# Altium schematic sheet AVRControlBoardMain.SchDoc
size A4
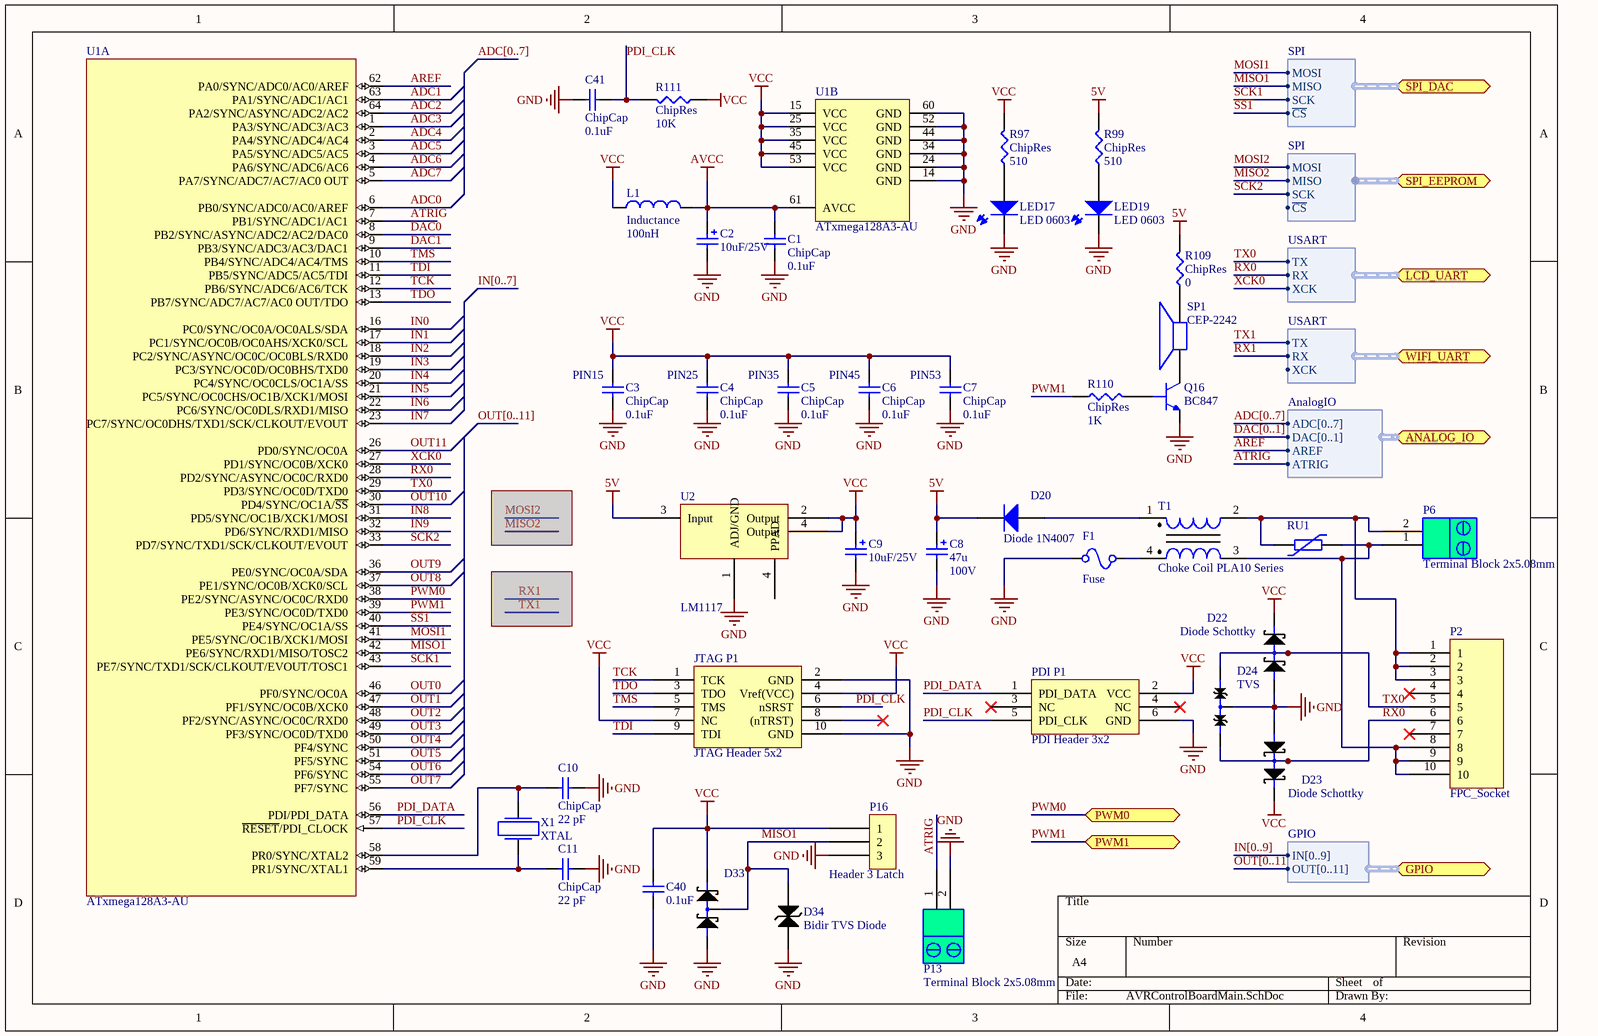
[diagram p0: AVRControlBoardMain.SchDoc]

## Parts
C1  ChipCap  value 0.1uF  [CAP0805]
C2  value 10uF/25V  [CAPC7343]  (hidden comment: Cap Pol SMD)
C3  ChipCap  value 0.1uF  [CAP0805]
C4  ChipCap  value 0.1uF  [CAP0805]
C5  ChipCap  value 0.1uF  [CAP0805]
C6  ChipCap  value 0.1uF  [CAP0805]
C7  ChipCap  value 0.1uF  [CAP0805]
C8  value 47u  Voltage: 100V  [CAPPR5-10x17_1]  (hidden comment: Cap Pol 100/47)
C9  value 10uF/25V  [CAPC7343]  (hidden comment: Cap Pol SMD)
C10  ChipCap  value 22 pF  [CAP0805]
C11  ChipCap  value 22 pF  [CAP0805]
C40  value 0.1uF  [CAP0805]  (hidden comment: ChipCap)
C41  ChipCap  value 0.1uF  [CAP0805]
D20  Diode 1N4007  [DO-41]
D22  Diode Schottky  [SOT23]
D23  Diode Schottky  [SOT23]
D24  TVS  [SOT23]
D33  Diode Schottky  [SOT23]  (value not drawn)
D34  Bidir TVS Diode  [DO-214AS]
F1  Fuse  [PTC1812]
JTAG_P1  JTAG Header 5x2  [Header 5x2]
L1  Inductance  value 100nH  [CM45]
LED17  LED 0603  [PLCC-2]
LED19  LED 0603  [PLCC-2]
P2  FPC_Socket  [Molex FPC/FFC 10pin]
P6  Terminal Block 2x5.08mm  [Socket 2x5.08]
P13  Terminal Block 2x5.08mm  [Socket 2x5.08]
P16  Header 3 Latch  [Header 3 latch]
PDI_P1  PDI Header 3x2  [Header 3x2]
Q16  BC847  [SOT23]
R97  ChipRes  value 510  [RES0805]
R99  ChipRes  value 510  [RES0805]
R109  ChipRes  value 0  [RES0805]
R110  ChipRes  value 1K  [RES0805]
R111  ChipRes  value 10K  [RES0805]
RU1  Varistor S14F25  [S14K25]  (value not drawn)
SP1  CEP-2242  [Buzzer]
T1  Choke Coil PLA10 Series  [PLA10]
U1  ATxmega128A3-AU  [64A_L]  (parts A,B of 2)
U2  LM1117  [SOT223-4M]
X1  XTAL  [BCY-W2/E4.7]

## Ports
ANALOG_IO (harness AnalogIO), GPIO (harness GPIO), LCD_UART (harness USART), PWM0, PWM1, SPI_DAC (harness SPI), SPI_EEPROM (harness SPI), WIFI_UART (harness USART)

## Harnesses
SPI: MOSI, MISO, SCK, ~{CS}
USART: TX, RX, XCK
AnalogIO: ADC[0..7], DAC[0..1], AREF, ATRIG
GPIO: IN[0..9], OUT[0..11]

## Nets
5V: C8.1 D20.2(K) R99.2 R109.2 U2.3(Input)
AVCC: C1.2 C2.1 L1.1 U1.61(AVCC)
GND: C1.1 C2.2 C3.1 C4.1 C5.1 C6.1 C7.1 C8.2 C9.2 C10.1 C11.1 C40.2 C41.1 D22.1 D23.1 D24.3 D33.1 D34.2 F1.1 JTAG_P1.2(GND) JTAG_P1.10(GND) LED17.1 LED19.1 P13.2 P16.3 PDI_P1.6(GND) Q16.2 U1.14(GND) U1.24(GND) U1.34(GND) U1.44(GND) U1.52(GND) U1.60(GND) U2.1(ADJ/GND)
VCC: C3.2 C4.2 C5.2 C6.2 C7.2 C9.1 C40.1 D22.2 D23.2 D33.2 JTAG_P1.4(Vref(VCC)) JTAG_P1.7(NC) L1.2 P16.1 PDI_P1.2(VCC) R97.2 R111.1 U1.15(VCC) U1.25(VCC) U1.35(VCC) U1.45(VCC) U1.53(VCC) U2.2(Output) U2.4(PPAD)
ADC0: U1.6(PB0/SYNC/ADC0/AC0/AREF)
ADC1: U1.63(PA1/SYNC/ADC1/AC1)
ADC2: U1.64(PA2/SYNC/ASYNC/ADC2/AC2)
ADC3: U1.1(PA3/SYNC/ADC3/AC3)
ADC4: U1.2(PA4/SYNC/ADC4/AC4)
ADC5: U1.3(PA5/SYNC/ADC5/AC5)
ADC6: U1.4(PA6/SYNC/ADC6/AC6)
ADC7: U1.5(PA7/SYNC/ADC7/AC7/AC0_OUT)
AREF: U1.62(PA0/SYNC/ADC0/AC0/AREF) ; port ANALOG_IO.AREF
ATRIG: P13.1 U1.7(PB1/SYNC/ADC1/AC1) ; port ANALOG_IO.ATRIG
DAC0: U1.8(PB2/SYNC/ASYNC/ADC2/AC2/DAC0)
DAC1: U1.9(PB3/SYNC/ADC3/AC3/DAC1)
IN0: U1.16(PC0/SYNC/OC0A/OC0ALS/SDA)
IN1: U1.17(PC1/SYNC/OC0B/OC0AHS/XCK0/SCL)
IN2: U1.18(PC2/SYNC/ASYNC/OC0C/OC0BLS/RXD0)
IN3: U1.19(PC3/SYNC/OC0D/OC0BHS/TXD0)
IN4: U1.20(PC4/SYNC/OC0CLS/OC1A/SS)
IN5: U1.21(PC5/SYNC/OC0CHS/OC1B/XCK1/MOSI)
IN6: U1.22(PC6/SYNC/OC0DLS/RXD1/MISO)
IN7: U1.23(PC7/SYNC/OC0DHS/TXD1/SCK/CLKOUT/EVOUT)
IN8: U1.31(PD5/SYNC/OC1B/XCK1/MOSI)
IN9: U1.32(PD6/SYNC/RXD1/MISO)
MISO1: D33.3 D34.1 P16.2 U1.42(PE6/SYNC/RXD1/MISO/TOSC2) ; port SPI_DAC.MISO
MISO2: port SPI_EEPROM.MISO
MOSI1: U1.41(PE5/SYNC/OC1B/XCK1/MOSI) ; port SPI_DAC.MOSI
MOSI2: port SPI_EEPROM.MOSI
OUT0: U1.46(PF0/SYNC/OC0A)
OUT1: U1.47(PF1/SYNC/OC0B/XCK0)
OUT2: U1.48(PF2/SYNC/ASYNC/OC0C/RXD0)
OUT3: U1.49(PF3/SYNC/OC0D/TXD0)
OUT4: U1.50(PF4/SYNC)
OUT5: U1.51(PF5/SYNC)
OUT6: U1.54(PF6/SYNC)
OUT7: U1.55(PF7/SYNC)
OUT8: U1.37(PE1/SYNC/OC0B/XCK0/SCL)
OUT9: U1.36(PE0/SYNC/OC0A/SDA)
OUT10: U1.30(PD4/SYNC/OC1A/~{SS})
OUT11: U1.26(PD0/SYNC/OC0A)
PDI_CLK: C41.2 JTAG_P1.6(nSRST) PDI_P1.5(PDI_CLK) R111.2 U1.57(~{RESET}/PDI_CLOCK)
PDI_DATA: PDI_P1.1(PDI_DATA) U1.56(PDI/PDI_DATA)
PWM0: U1.38(PE2/SYNC/ASYNC/OC0C/RXD0) ; port PWM0
PWM1: R110.1 U1.39(PE3/SYNC/OC0D/TXD0) ; port PWM1
RX0: D23.3 D24.2 P2.6 U1.28(PD2/SYNC/ASYNC/OC0C/RXD0) ; port LCD_UART.RX
RX1: port WIFI_UART.RX
~{SS1}: U1.40(PE4/SYNC/OC1A/SS) ; port SPI_DAC.~{CS}
SCK1: U1.43(PE7/SYNC/TXD1/SCK/CLKOUT/EVOUT/TOSC1) ; port SPI_DAC.SCK
SCK2: U1.33(PD7/SYNC/TXD1/SCK/CLKOUT/EVOUT) ; port SPI_EEPROM.SCK
TCK: JTAG_P1.1(TCK) U1.12(PB6/SYNC/ADC6/AC6/TCK)
TDI: JTAG_P1.9(TDI) U1.11(PB5/SYNC/ADC5/AC5/TDI)
TDO: JTAG_P1.3(TDO) U1.13(PB7/SYNC/ADC7/AC7/AC0_OUT/TDO)
TMS: JTAG_P1.5(TMS) U1.10(PB4/SYNC/ADC4/AC4/TMS)
TX0: D22.3 D24.1 P2.5 U1.29(PD3/SYNC/OC0D/TXD0) ; port LCD_UART.TX
TX1: port WIFI_UART.TX
XCK0: U1.27(PD1/SYNC/OC0B/XCK0) ; port LCD_UART.XCK
NetC10_2: C10.2 U1.58(PR0/SYNC/XTAL2) X1.2
NetC11_2: C11.2 U1.59(PR1/SYNC/XTAL1) X1.1
NetD20_1: D20.1(A) T1.1
NetF1_2: F1.2 T1.4
NetLED17_2: LED17.2 R97.1
NetLED19_2: LED19.2 R99.1
NetP2_1: P2.1 P2.2 P2.3 P6.2 RU1.1 T1.2
NetP2_8: P2.8 P2.9 P2.10 P6.1 RU1.2 T1.3
NetQ16_1: Q16.1 R110.2
NetQ16_3: Q16.3 SP1.1
NetR109_1: R109.1 SP1.2

Not connected (* = marked no-connect by the designer): JTAG_P1 8((nTRST))*; P2 4* 7*; PDI_P1 3(NC)* 4(NC)*

## Buses and harness runs
bus ADC[0..7]
bus DAC[0..1]
bus IN[0..7]
bus IN[0..9]
bus OUT[0..11]

## Notes on the sheet
- (near C3) PIN15
- (near C4) PIN25
- (near C5) PIN35
- (near C6) PIN45
- (near C7) PIN53

## Library data of the parts
C1 C3-C7 C10 C11 C40 C41 = ChipCap: Capacitor; Published: 8-Jun-2000; LatestRevisionDate: 17-Jul-2002; LatestRevisionNote: Re-released for DXP Platform.; PackageReference: RAD-0.3; Publisher: Altium Limited
C2 C9 = Cap Pol Chip: Polarized Capacitor (Radial); Supplier 1: Digi-Key; Supplier Part Number 1: 399-4029-1-ND
C8 = Cap Pol 100/47: Polarized Capacitor (Radial); Supplier 1: Digi-Key; Supplier Part Number 1: P1284-ND
D20 = Diode 1N4007: 1 Amp General Purpose Rectifier; Published: 8-Jun-2000; LatestRevisionDate: 17-Jul-2002; LatestRevisionNote: Re-released for DXP Platform.; DatasheetVersion: 1998; PackageVersion: Aug-1999; PackageReference: DO-41; Publisher: Altium Limited; PackageDescription: Diode, Axial; Body 5.2 x 2.7 mm (LxDia. max), Lead Dia. 0.86 mm (max); Code_JEDEC: DO-204-AL; ComponentLink1Description: Manufacturer Link; ComponentLink1URL: http://www.fairchildsemi.com/; ComponentLink2Description: Datasheet; ComponentLink2URL: http://www.fairchildsemi.com/ds/1N%2F1N4001.pdf
D22 D23 D33 = Schottky Diode: 2-Diode Schottky
D24 = TVS Diode: Dual bidirectional voltage supresor
D34 = TVS Bidir Diode SMA
F1 = Fuse PTC1812: Fuse PTC 1812 Thermoresistor
JTAG_P1 = JTAG Header 5x2: JTAG Interface connctor
L1 = ChipInductance
LED17 LED19 = LED0603
P6 P13 = Socket_2x5.08_RA_2Wall: Terminal Block Socket Right Angle 2x5.08mm 2 Wall
P16 = Header 3 latch: Header 3 with latch
PDI_P1 = PDI Header 3x2: PDI Interface connector
Q16 = BC847: NPN transistor
R97 R99 R109-R111 = ChipRes: Chip resistor
RU1 = Varistor S14K25: varistor
SP1 = Buzzer CEP-2242: Buzzer
T1 = Choke Coil: Common Mode Rejection Choke Coil LA10 Series
U1 = ATxmega128A3-AU: 8/16-bit AVR XMEGA A3 Microcontroller, 1.6-3.6V, 128KB + 8KB Flash, 2KB EEPROM, 8KB SRAM, 64-pin TQFP, Industrial Grade (-40°C to 85°C), Pb-Free; Published: 1-Apr-2010; DatasheetVersion: revQ, Feb-2010; PackageVersion: revB, Oct-2001; PackageReference: 64A; Publisher: Altium Limited; PackageDescription: 64-Pin Plastic Thin Profile Quad Flat Pack, 14 x 14 x 1.0 mm Body, 0.8 mm Pitch (TQFP); Supplier 1: Digi-Key; Supplier Part Number 1: ATXMEGA128A3-AU-ND; Supplier 2: Farnell; Supplier Part Number 2: 1748550; Supplier 3: Mouser; Supplier Part Number 3: 556-ATXMEGA128A3-AU; Code_JEDEC: MS-026-AEB; ComponentLink1Description: Manufacturer Link; ComponentLink1URL: http://www.atmel.com/products/avr/default.asp?; ComponentLink2Description: ATxmega64A3/128A3/192A3/256A3 Datasheet; ComponentLink2URL: http://www.atmel.com/dyn/resources/prod_documents/doc8068.pdf; ComponentLink3Description: Atmel.com Home; ComponentLink3URL: http://www.atmel.com
U2 = LM1117: Power Mgt Voltage Regulator
X1 = Crystall oscillator: Quartz crystall oscillator